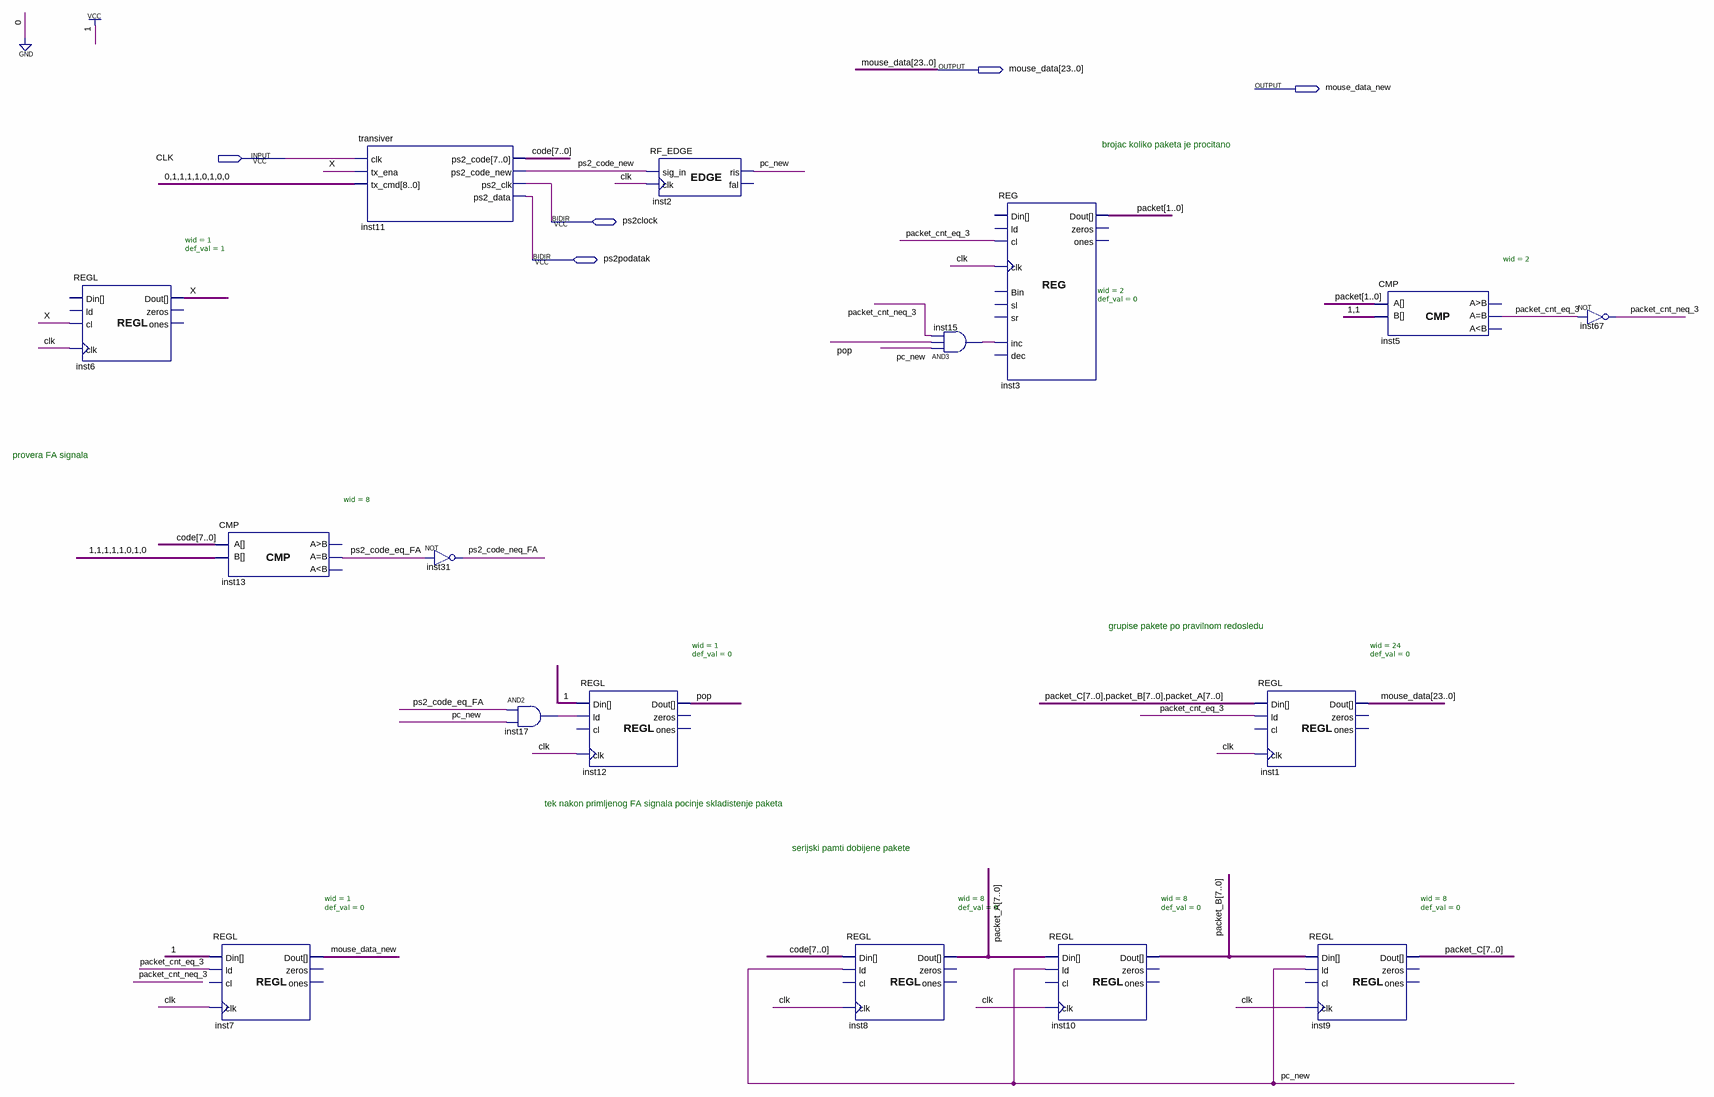
[diagram p0: schematic sheet]
// Quartus schematic mis.bdf as structural Verilog: 16 symbols, 5 pins
module mis (
  input  CLK,
  inout  ps2clock,
  inout  ps2podatak,
  output [23:0] mouse_data,
  output mouse_data_new
);

  wire inst15_out, inst17_out, packet_cnt_eq_3, packet_cnt_neq_3, pc_new, pop, ps2_code_eq_FA,
       ps2_code_neq_FA, ps2_code_new, X;
  wire [1:0] packet;
  wire [7:0] code, packet_A, packet_B, packet_C;

  REGL #(.wid(1), .def_val(1)) inst6 (.cl(X), .clk(CLK), .Dout(X));  // open: Din, ld, zeros, ones
  CMP #(.wid(8)) inst13 (.A(code), .B(8'b11111010), .eq(ps2_code_eq_FA));  // open: gr, ls
  REGL #(.wid(1), .def_val(0)) inst7 (
    .Din(1'b1), .ld(packet_cnt_eq_3), .clk(CLK), .Dout(mouse_data_new));  // open: cl, zeros, ones
  transiver inst11 (
    .clk(CLK), .tx_ena(X), .tx_cmd(9'b011110100), .ps2_code(code), .ps2_code_new(ps2_code_new),
    .ps2_clk(ps2clock), .ps2_data(ps2podatak));
  not inst31 (ps2_code_neq_FA, ps2_code_eq_FA);
  and inst17 (inst17_out, ps2_code_eq_FA, pc_new);
  REGL #(.wid(1), .def_val(0)) inst12 (.Din(1'b1), .ld(inst17_out), .clk(CLK), .Dout(pop));  // open: cl, zeros, ones
  RF_EDGE inst2 (.sig_in(ps2_code_new), .clk(CLK), .ris(pc_new));  // open: fal
  REGL #(.wid(8), .def_val(0)) inst8 (.Din(code), .ld(pc_new), .clk(CLK), .Dout(packet_A));  // open: cl, zeros, ones
  and inst15 (inst15_out, pc_new, pop, packet_cnt_neq_3);
  REG #(.wid(2), .def_val(0)) inst3 (
    .cl(packet_cnt_eq_3), .clk(CLK), .inc(inst15_out), .Dout(packet));  // open: ld, Bin, sl, sr, dec, Din, zeros, ones
  REGL #(.wid(8), .def_val(0)) inst10 (
    .Din(packet_A), .ld(pc_new), .clk(CLK), .Dout(packet_B));  // open: cl, zeros, ones
  REGL #(.wid(24), .def_val(0)) inst1 (
    .Din({packet_C, packet_B, packet_A}), .ld(packet_cnt_eq_3), .clk(CLK), .Dout(mouse_data));  // open: cl, zeros, ones
  REGL #(.wid(8), .def_val(0)) inst9 (
    .Din(packet_B), .ld(pc_new), .clk(CLK), .Dout(packet_C));  // open: cl, zeros, ones
  CMP #(.wid(2)) inst5 (.A(packet), .B(2'b11), .eq(packet_cnt_eq_3));  // open: gr, ls
  not inst67 (packet_cnt_neq_3, packet_cnt_eq_3);

  // Notes on the sheet:
  //   brojac koliko paketa je procitano
  //   provera FA signala
  //   grupise pakete po pravilnom redosledu
  //   tek nakon primljenog FA signala pocinje skladistenje paketa        
  //   serijski pamti dobijene pakete
endmodule
